# Altium schematic sheet 1XGSH00_BATTERY.SchDoc
size A4
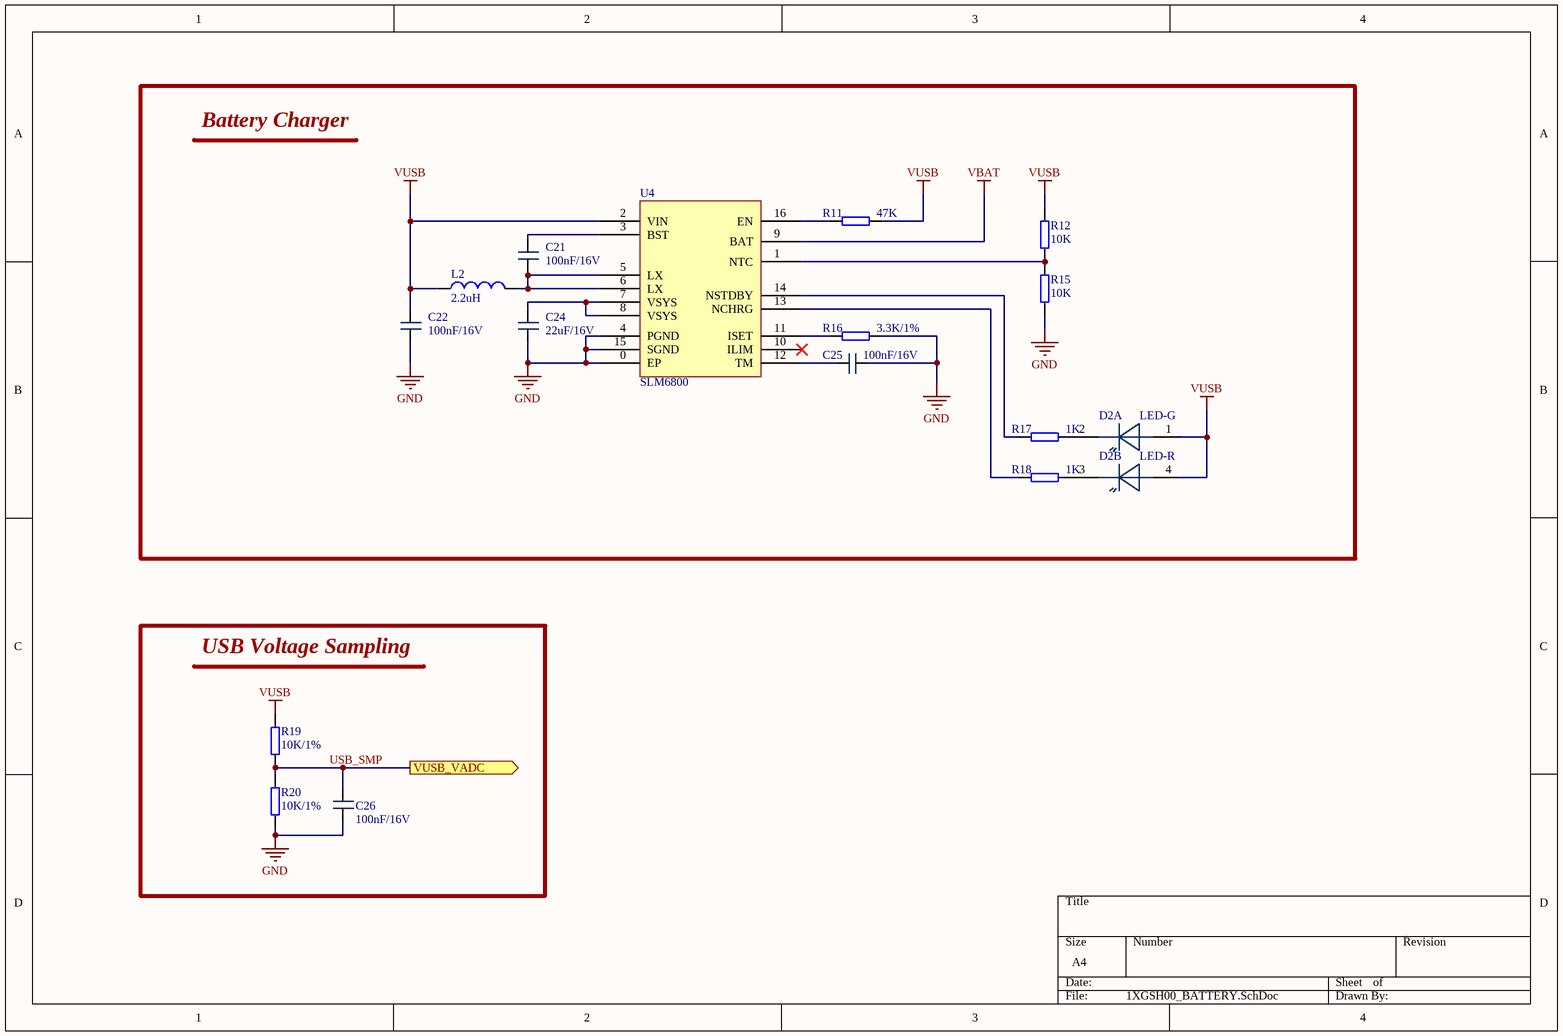
[diagram p0: 1XGSH00_BATTERY.SchDoc]

## Parts
C21  100nF/16V  [0805_C]
C22  100nF/16V  [0603_C]
C24  22uF/16V  [0805_C]
C25  100nF/16V  [0805_C]
C26  100nF/16V  [0402_C]
D2  LED-G  [3528_LED]  (parts A,B of 2)
L2  2.2uH  [INDUCTOR_4*4]
R11  47K  [0402_R]
R12  10K  [0402_R]
R15  10K  [0402_R]
R16  3.3K/1%  [0402_R]
R17  1K  [0402_R]
R18  1K  [0402_R]
R19  10K/1%  [0402_R]
R20  10K/1%  [0402_R]
U4  SLM6800  [QFN-16_L4.0-W4.0-P0.65-LS4.2-BL-EP]

## Blocks framed on the sheet
Battery Charger: C21 C22 C24 C25 D2 L2 R11 R12 R15-R18 U4
USB Voltage Sampling: C26 R19 R20

## Ports
VUSB_VADC (out)

## Nets
GND: C22.1(-) C24.1(-) C25.2(-) C26.1(-) R15.2 R16.2 R20.2 U4.0(EP) U4.4(PGND) U4.15(SGND)
VBAT: U4.9(BAT)
VUSB: C22.2(-) D2.1 D2.4 L2.1 R11.2 R12.1 R19.1 U4.2(VIN)
USB_SMP: C26.2(-) R19.2 R20.1 ; port VUSB_VADC
NetC21_1: C21.1(-) L2.2 U4.5(LX) U4.6(LX)
NetC21_2: C21.2(-) U4.3(BST)
NetC24_2: C24.2(-) U4.7(VSYS) U4.8(VSYS)
NetC25_1: C25.1(-) U4.12(TM)
NetD2_2: D2.2 R17.2
NetD2_3: D2.3 R18.2
NetR11_1: R11.1 U4.16(EN)
NetR12_2: R12.2 R15.1 U4.1(NTC)
NetR16_1: R16.1 U4.11(ISET)
NetR17_1: R17.1 U4.14(NSTDBY)
NetR18_1: R18.1 U4.13(NCHRG)

Not connected (* = marked no-connect by the designer): U4 10(ILIM)*

## Library data of the parts
C21 C22 C24-C26 = Capacitor
D2 = LED_Dual_2: Dual LED Single Package
L2 = Inductor: Code_IEC: 1005; Published: 8-Jun-2000; LatestRevisionDate: 29-May-2009; LatestRevisionNote: IPC-7351 Footprint Added.; PackageReference: 0402-A; Publisher: Altium Limited; PackageDescription: Chip Inductor; Code_JEITA: 0402
R11 R12 R15 R16 R19 R20 = Resistor: Value: 1K
R17 R18 = Resistor: Value: 1K
U4 = SLM6800: 5V 输入两节锂电池升压充电IC